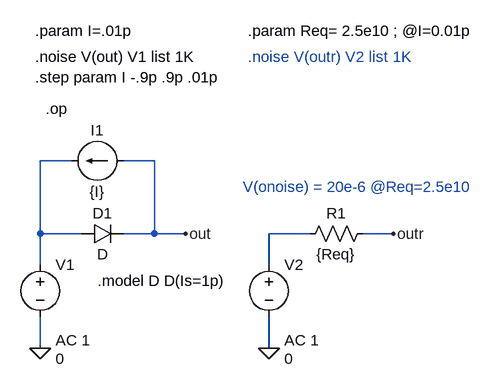
[diagram p0: schematic new_diode_noise.asc]
new_diode_noise.asc, the LTspice schematic file:
Version 4
SHEET 1 880 680
WIRE -48 -64 -96 -64
WIRE 80 -64 32 -64
WIRE -96 48 -96 -64
WIRE -32 48 -96 48
WIRE 80 48 80 -64
WIRE 80 48 32 48
WIRE 128 48 80 48
WIRE 320 48 256 48
WIRE 448 48 400 48
WIRE -96 96 -96 48
WIRE 256 96 256 48
WIRE -96 224 -96 176
WIRE 256 224 256 176
FLAG 128 48 out
FLAG -96 224 0
FLAG 256 224 0
FLAG 448 48 outr
SYMBOL diode -32 64 R270
WINDOW 0 32 32 VTop 0
WINDOW 3 0 32 VBottom 0
SYMATTR InstName D1
SYMBOL voltage -96 80 R0
WINDOW 3 24 160 Left 0
WINDOW 123 24 132 Left 0
WINDOW 39 0 0 Left 0
SYMATTR Value 0
SYMATTR Value2 AC 1
SYMATTR InstName V1
SYMBOL current 32 -64 R90
WINDOW 0 -32 40 VBottom 0
WINDOW 3 32 40 VTop 0
SYMATTR InstName I1
SYMATTR Value {I}
SYMBOL res 304 64 R270
WINDOW 0 32 56 VTop 0
WINDOW 3 0 56 VBottom 0
SYMATTR InstName R1
SYMATTR Value {Req}
SYMBOL voltage 256 80 R0
WINDOW 3 24 160 Left 0
WINDOW 123 24 132 Left 0
WINDOW 39 0 0 Left 0
SYMATTR Value 0
SYMATTR Value2 AC 1
SYMATTR InstName V2
TEXT -104 -224 Left 0 !.noise V(out) V1 list 1K\n.step param I -.9p .9p .01p
TEXT -8 120 Left 0 !.model D D(Is=1p)
TEXT -88 -144 Left 0 !.op
TEXT -104 -264 Left 0 !.param I=.01p
TEXT 224 -224 Left 0 ;.noise V(outr) V2 list 1K
TEXT 224 -264 Left 0 !.param Req= 2.5e10 ; @I=0.01p
TEXT 216 -24 Left 0 ;V(onoise) = 20e-6 @Req=2.5e10

The netlist it stands for:
* new_diode_noise.asc
D1 N001 out D
V1 N001 0 0 AC 1
I1 out N001 {I}
R1 N002 outr {Req}
V2 N002 0 0 AC 1
.model D D
.lib standard.dio
.noise V(out) V1 list 1K
.step param I -.9p .9p .01p
.model D D(Is=1p)
.op
.param I=.01p
* .noise V(outr) V2 list 1K
.param Req= 2.5e10 ; @I=0.01p
* V(onoise) = 20e-6 @Req=2.5e10
.backanno
.end